# EAGLE design Schematic (EAGLE 9.4.2)
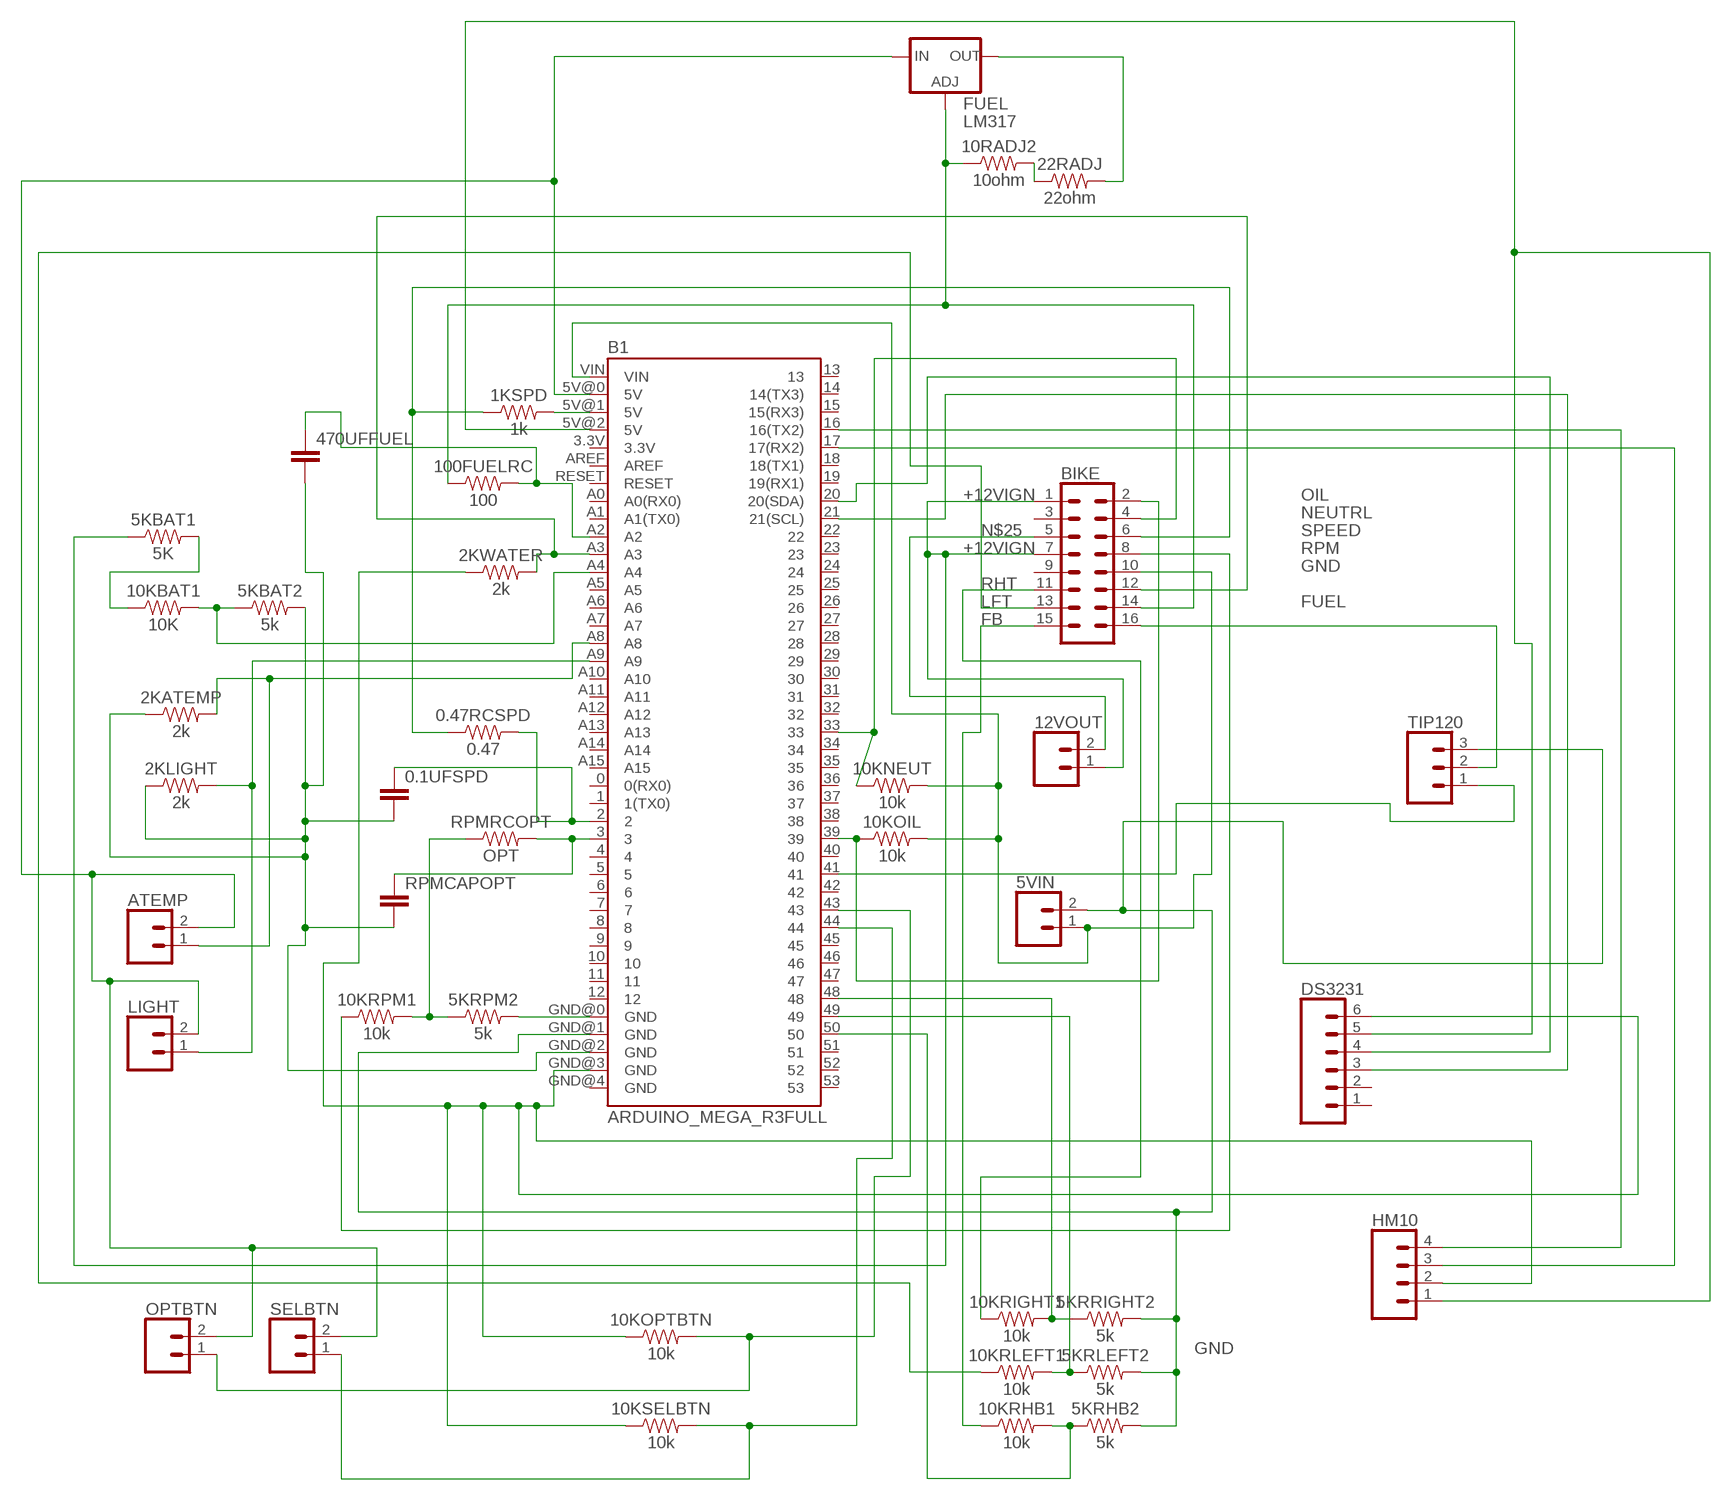
[diagram p0: schematic, sheet 1]

## Parts
0.1UFSPD  C2,5-3  [C2.5-3]
0.47RCSPD  0.47  1KOHM-HORIZ-1/4W-5%  [AXIAL-0.3]
1KSPD  1k  1KOHM-HORIZ-1/4W-5%  [AXIAL-0.3]
2KATEMP  2k  1KOHM-HORIZ-1/4W-5%  [AXIAL-0.3]
2KLIGHT  2k  1KOHM-HORIZ-1/4W-5%  [AXIAL-0.3]
2KWATER  2k  1KOHM-HORIZ-1/4W-5%  [AXIAL-0.3]
5KBAT1  5K  1KOHM-HORIZ-1/4W-5%  [AXIAL-0.3]
5KBAT2  5k  1KOHM-HORIZ-1/4W-5%  [AXIAL-0.3]
5KRHB2  5k  1KOHM-HORIZ-1/4W-5%  [AXIAL-0.3]
5KRLEFT2  5k  1KOHM-HORIZ-1/4W-5%  [AXIAL-0.3]
5KRPM2  5k  1KOHM-HORIZ-1/4W-5%  [AXIAL-0.3]
5KRRIGHT2  5k  1KOHM-HORIZ-1/4W-5%  [AXIAL-0.3]
5VIN  CONN_02PTH4  [1X02_XTRA_BIG]
10KBAT1  10K  1KOHM-HORIZ-1/4W-5%  [AXIAL-0.3]
10KNEUT  10k  1KOHM-HORIZ-1/4W-5%  [AXIAL-0.3]
10KOIL  10k  1KOHM-HORIZ-1/4W-5%  [AXIAL-0.3]
10KOPTBTN  10k  1KOHM-HORIZ-1/4W-5%  [AXIAL-0.3]
10KRHB1  10k  1KOHM-HORIZ-1/4W-5%  [AXIAL-0.3]
10KRIGHT1  10k  1KOHM-HORIZ-1/4W-5%  [AXIAL-0.3]
10KRLEFT1  10k  1KOHM-HORIZ-1/4W-5%  [AXIAL-0.3]
10KRPM1  10k  1KOHM-HORIZ-1/4W-5%  [AXIAL-0.3]
10KSELBTN  10k  1KOHM-HORIZ-1/4W-5%  [AXIAL-0.3]
10RADJ2  10ohm  1KOHM-HORIZ-1/4W-5%  [AXIAL-0.3]
12VOUT  CONN_02PTH4  [1X02_XTRA_BIG]
22RADJ  22ohm  1KOHM-HORIZ-1/4W-5%  [AXIAL-0.3]
100FUELRC  100  1KOHM-HORIZ-1/4W-5%  [AXIAL-0.3]
470UFFUEL  C2,5-3  [C2.5-3]
ATEMP  CONN_02  [1X02]
B1  ARDUINO_MEGA_R3FULL  [ARDUINO_MEGA]
BIKE  CONN_08X2  [2X8]
DS3231  CONN_06SILK_FEMALE_PTH  [1X06]
FUEL  LM317  V_REG_317SINK  [TO220-ADJ]
HM10  CONN_04  [1X04]
LIGHT  CONN_02  [1X02]
OPTBTN  CONN_02  [1X02]
RPMCAPOPT  C2,5-3  [C2.5-3]
RPMRCOPT  OPT  1KOHM-HORIZ-1/4W-5%  [AXIAL-0.3]
SELBTN  CONN_02  [1X02]
TIP120  CONN_03  [1X03]

## Nets
+12VIGN: 5KBAT1.P$1 12VOUT.1 BIKE.1 BIKE.7
FB: 10KRHB1.P$1 BIKE.15
FUEL: 10RADJ2.P$1 100FUELRC.P$1 BIKE.14 FUEL.ADJ
GND: 5KRHB2.P$2 5KRLEFT2.P$2 5KRRIGHT2.P$2 5VIN.2 B1.GND@1(GND) TIP120.3
LFT: 10KRLEFT1.P$1 BIKE.13
N$1: 2KWATER.P$2 B1.A3 BIKE.12
N$2: 1KSPD.P$2 B1.5V@1(5V)
N$3: 5KRPM2.P$2 B1.GND@0(GND)
N$4: 5KRPM2.P$1 10KRPM1.P$2 RPMRCOPT.P$1
N$5: 2KWATER.P$1 10KOPTBTN.P$1 10KSELBTN.P$1 B1.GND@3(GND) DS3231.6 HM10.2
N$6: 5KBAT1.P$2 10KBAT1.P$1
N$7: 22RADJ.P$2 FUEL.OUT
N$8: 0.1UFSPD.1 0.47RCSPD.P$2 B1.2
N$9: ATEMP.2 B1.5V@0(5V) FUEL.IN LIGHT.2 OPTBTN.2 SELBTN.2
N$10: B1.3 RPMCAPOPT.1 RPMRCOPT.P$2
N$11: 10RADJ2.P$2 22RADJ.P$1
N$12: 5VIN.1 10KNEUT.P$2 10KOIL.P$2 B1.VIN BIKE.10
N$13: B1.41 TIP120.1
N$14: BIKE.16 TIP120.2
N$15: 5KBAT2.P$1 10KBAT1.P$2 B1.A4
N$16: 0.1UFSPD.2 2KATEMP.P$1 2KLIGHT.P$1 5KBAT2.P$2 470UFFUEL.2 B1.GND@2(GND) RPMCAPOPT.2
N$17: 100FUELRC.P$2 470UFFUEL.1 B1.A2
N$18: 2KATEMP.P$2 ATEMP.1 B1.A8
N$19: 2KLIGHT.P$2 B1.A9 LIGHT.1
N$20: 10KOPTBTN.P$2 B1.43 OPTBTN.1
N$21: 10KSELBTN.P$2 B1.44 SELBTN.1
N$22: 5KRRIGHT2.P$1 10KRIGHT1.P$2 B1.48
N$23: 5KRLEFT2.P$1 10KRLEFT1.P$2 B1.49
N$24: 5KRHB2.P$1 10KRHB1.P$2 B1.50
N$25: 12VOUT.2 BIKE.5
N$26: B1.5V@2(5V) DS3231.5 HM10.1
N$27: B1.20(20(SDA)) DS3231.4
N$28: B1.21(21(SCL)) DS3231.3
N$29: B1.16(16(TX2)) HM10.4
N$30: B1.17(17(RX2)) HM10.3
NEUTRL: 10KNEUT.P$1 B1.33 BIKE.4
OIL: 10KOIL.P$1 B1.39 BIKE.2
RHT: 10KRIGHT1.P$1 BIKE.11
RPM: 10KRPM1.P$1 BIKE.8
SPEED: 0.47RCSPD.P$1 1KSPD.P$1 BIKE.6
Unconnected: B1.0(0(RX0)) B1.1(1(TX0)) B1.3.3V B1.4 B1.5 B1.6 B1.7 B1.8 B1.9 B1.10 B1.11 B1.12 B1.13 B1.14(14(TX3)) B1.15(15(RX3)) B1.18(18(TX1)) B1.19(19(RX1)) B1.22 B1.23 B1.24 B1.25 B1.26 B1.27 B1.28 B1.29 B1.30 B1.31 B1.32 B1.34 B1.35 B1.36 B1.37 B1.38 B1.40 B1.42 B1.45 B1.46 B1.47 B1.51 B1.52 B1.53 B1.A0(A0(RX0)) B1.A1(A1(TX0)) B1.A5 B1.A6 B1.A7 B1.A10 B1.A11 B1.A12 B1.A13 B1.A14 B1.A15 B1.AREF B1.GND@4(GND) B1.RESET BIKE.3 BIKE.9 DS3231.1 DS3231.2

## Library data of the parts
0.1UFSPD 470UFFUEL RPMCAPOPT = capacitor-wima:C: CAPACITOR naming: grid - package width
0.47RCSPD 2KATEMP 2KLIGHT 2KWATER 5KBAT1 5KBAT2 5KRHB2 5KRLEFT2 5KRPM2 5KRRIGHT2 10KBAT1 10KNEUT 10KOIL 10KOPTBTN 10KRHB1 10KRIGHT1 10KRLEFT1 10KRPM1 10KSELBTN 10RADJ2 22RADJ 100FUELRC RPMRCOPT = SparkFun-Resistors:1KOHM: 1kΩ resistor A resistor is a passive two-terminal electrical component that implements electrical resistance as a circuit element. Resistors act to reduce current flow, and, at the same time, act to lower voltage levels within circuits. - Wikipedia; PROD_ID: RES-08380; VALUE: 1k
1KSPD = SparkFun-Resistors:1KOHM: 1kΩ resistor A resistor is a passive two-terminal electrical component that implements electrical resistance as a circuit element. Resistors act to reduce current flow, and, at the same time, act to lower voltage levels within circuits. - Wikipedia; PROD_ID: RES-08380
5VIN 12VOUT ATEMP LIGHT OPTBTN SELBTN = SparkFun-Connectors:CONN_02: Multi connection point. Often used as Generic Header-pin footprint for 0.1 inch spaced/style header connections On any of the 0.1 inch spaced packages, you can populate with these: Break Away Headers - Straight <https://www.sparkfun.com/products/116> (PRT-00116) Break Away Male Headers - Right Angle <https://www.sparkfun.com/products/553> (PRT-00553) Female Headers <https://www.sparkfun.com/products/115> (PRT-00115) Break Away Headers - Machine Pin <https://www.sparkfun.com/products/117> (PRT-00117) Break Away Female Headers - Swiss Machine Pin <https://www.sparkfun.com/products/743> (PRT-00743) For SCREWTERMINALS and SPRING TERMINALS visit here: Screw Terimnals on SparkFun.com <https://www.sparkfun.com/search/results?term=Screw+Terminals> (5mm/3.5mm/2.54mm spacing) This device is also useful as a general connection point to wire up your design to another part of your project. Our various solder wires solder well into these plated through hole pads. Hook-Up Wire - Assortment (Stranded, 22 AWG) <https://www.sparkfun.com/products/11375> (PRT-11375) Hook-Up Wire - Assortment (Solid Core, 22 AWG) <https://www.sparkfun.com/products/11367> (PRT-11367) View the entire wire category on our website here <https://www.sparkfun.com/categories/141> Special notes: Molex polarized connector foot print use with: PRT-08233 with associated crimp pins and housings. 2.54_SCREWTERM for use with PRT-10571. 3.5mm Screw Terminal footprints for PRT-08084 5mm Screw Terminal footprints for use with PRT-08432
B1 = SparkFun-Boards:ARDUINO_MEGA_R3: Arduino Mega R3 ATmega2560 R3 compatible footprint. SparkFun Products: Arduino Mega 2560 R3 <https://www.sparkfun.com/products/11061>
BIKE = SparkFun-Connectors:CONN_08X2: Multi connection point. Often used as Generic Header-pin footprint for 0.1 inch spaced/style header connections You can populate with any combo of single row headers, but if you'd like an exact match, check this: Header - 2x8 (Male, 0.1") <https://www.sparkfun.com/products/13156> (PRT-13156) On any of the 0.1 inch spaced packages, you can populate with these: Break Away Headers - Straight <https://www.sparkfun.com/products/116> (PRT-00116) Break Away Male Headers - Right Angle <https://www.sparkfun.com/products/553> (PRT-00553) Female Headers <https://www.sparkfun.com/products/115> (PRT-00115) Break Away Headers - Machine Pin <https://www.sparkfun.com/products/117> (PRT-00117) Break Away Female Headers - Swiss Machine Pin <https://www.sparkfun.com/products/743> (PRT-00743)
DS3231 = SparkFun-Connectors:CONN_06: Multi connection point. Often used as Generic Header-pin footprint for 0.1 inch spaced/style header connections On any of the 0.1 inch spaced packages, you can populate with these: Break Away Headers - Straight <https://www.sparkfun.com/products/116> (PRT-00116) Break Away Male Headers - Right Angle <https://www.sparkfun.com/products/553> (PRT-00553) Female Headers <https://www.sparkfun.com/products/115> (PRT-00115) Break Away Headers - Machine Pin <https://www.sparkfun.com/products/117> (PRT-00117) Break Away Female Headers - Swiss Machine Pin <https://www.sparkfun.com/products/743> (PRT-00743) Arduino Stackable Header - 6 Pin <https://www.sparkfun.com/products/9280> (PRT-09280) For SCREWTERMINALS and SPRING TERMINALS visit here: Screw Terimnals on SparkFun.com <https://www.sparkfun.com/search/results?term=Screw+Terminals> (5mm/3.5mm/2.54mm spacing) This device is also useful as a general connection point to wire up your design to another part of your project. Our various solder wires solder well into these plated through hole pads. Hook-Up Wire - Assortment (Stranded, 22 AWG) <https://www.sparkfun.com/products/11375> (PRT-11375) Hook-Up Wire - Assortment (Solid Core, 22 AWG) <https://www.sparkfun.com/products/11367> (PRT-11367) View the entire wire category on our website here <https://www.sparkfun.com/categories/141>; PROD_ID: CONN-08437
FUEL = SparkFun-IC-Power:V_REG_317: Voltage Regulator Standard LM317 adjustable voltage regulator. AOI (Adjust Output Input). Google 'LM317 Calculator' for easy to use app to get the two resistor values needed. 240/720 for 5V output. 240/390 for 3.3V output. Spark Fun Electronics SKU : COM-00527
HM10 = SparkFun-Connectors:CONN_04: Multi connection point. Often used as Generic Header-pin footprint for 0.1 inch spaced/style header connections On any of the 0.1 inch spaced packages, you can populate with these: Break Away Headers - Straight <https://www.sparkfun.com/products/116> (PRT-00116) Break Away Male Headers - Right Angle <https://www.sparkfun.com/products/553> (PRT-00553) Female Headers <https://www.sparkfun.com/products/115> (PRT-00115) Break Away Headers - Machine Pin <https://www.sparkfun.com/products/117> (PRT-00117) Break Away Female Headers - Swiss Machine Pin <https://www.sparkfun.com/products/743> (PRT-00743) For SCREWTERMINALS and SPRING TERMINALS visit here: Screw Terimnals on SparkFun.com <https://www.sparkfun.com/search/results?term=Screw+Terminals> (5mm/3.5mm/2.54mm spacing) This device is also useful as a general connection point to wire up your design to another part of your project. Our various solder wires solder well into these plated through hole pads. Hook-Up Wire - Assortment (Stranded, 22 AWG) <https://www.sparkfun.com/products/11375> (PRT-11375) Hook-Up Wire - Assortment (Solid Core, 22 AWG) <https://www.sparkfun.com/products/11367> (PRT-11367) View the entire wire category on our website here <https://www.sparkfun.com/categories/141> Special notes: Molex polarized connector foot print use with SKU : PRT-08231 with associated crimp pins and housings. 1MM SMD Version SKU: PRT-10208; PROD_ID: CONN-09696
TIP120 = SparkFun-Connectors:CONN_03: Multi connection point. Often used as Generic Header-pin footprint for 0.1 inch spaced/style header connections On any of the 0.1 inch spaced packages, you can populate with these: Break Away Headers - Straight <https://www.sparkfun.com/products/116> (PRT-00116) Break Away Male Headers - Right Angle <https://www.sparkfun.com/products/553> (PRT-00553) Female Headers <https://www.sparkfun.com/products/115> (PRT-00115) Break Away Headers - Machine Pin <https://www.sparkfun.com/products/117> (PRT-00117) Break Away Female Headers - Swiss Machine Pin <https://www.sparkfun.com/products/743> (PRT-00743) Stackable Header - 3 Pin (Female, 0.1") <https://www.sparkfun.com/products/13875> (PRT-13875) For SCREWTERMINALS and SPRING TERMINALS visit here: Screw Terimnals on SparkFun.com <https://www.sparkfun.com/search/results?term=Screw+Terminals> (5mm/3.5mm/2.54mm spacing) This device is also useful as a general connection point to wire up your design to another part of your project. Our various solder wires solder well into these plated through hole pads. Hook-Up Wire - Assortment (Stranded, 22 AWG) <https://www.sparkfun.com/products/11375> (PRT-11375) Hook-Up Wire - Assortment (Solid Core, 22 AWG) <https://www.sparkfun.com/products/11367> (PRT-11367) View the entire wire category on our website here <https://www.sparkfun.com/categories/141> Special notes: Molex polarized connector foot print use with SKU : PRT-08232 with associated crimp pins and housings.

## Board
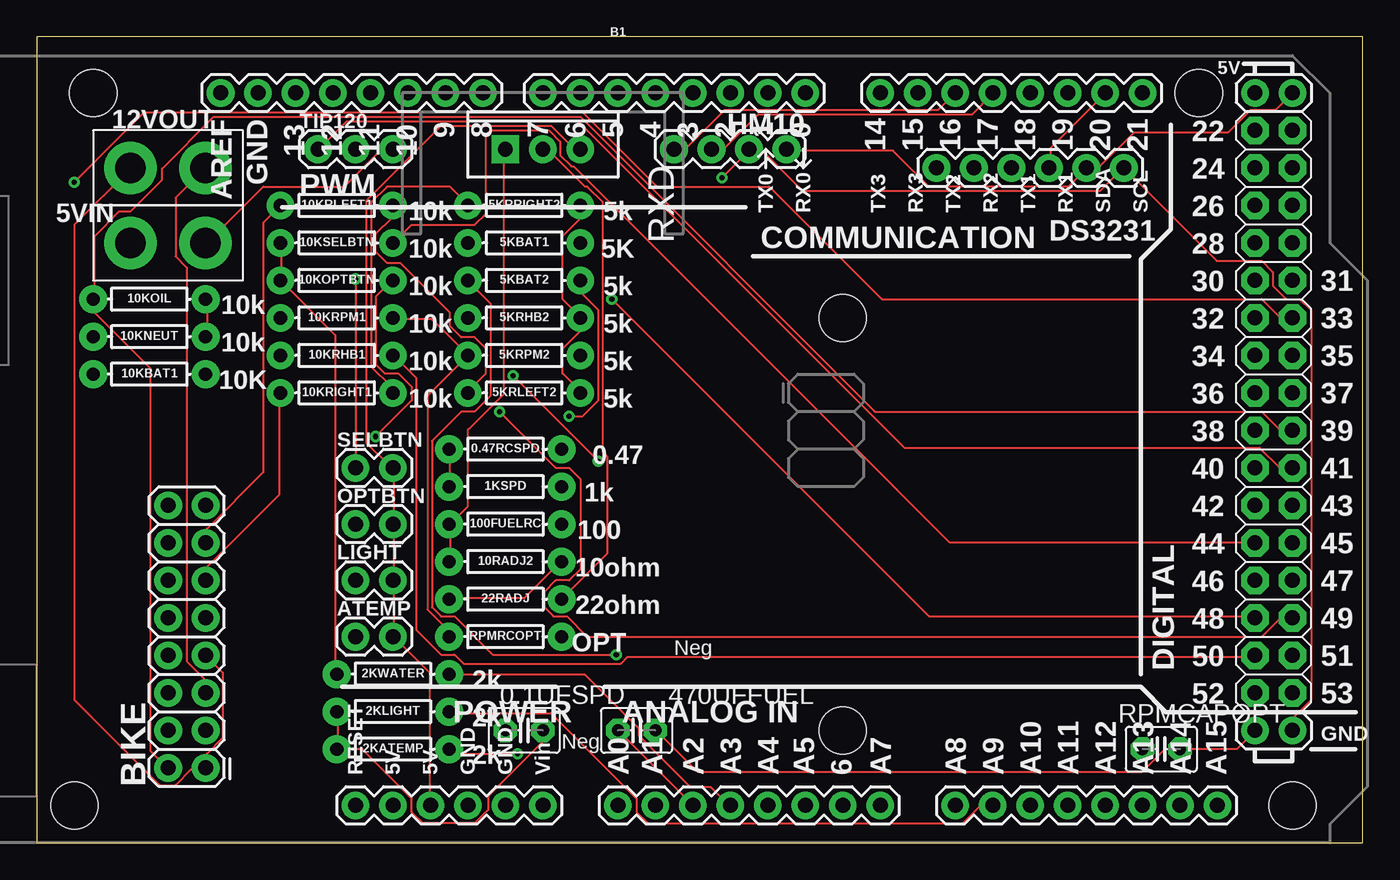
[diagram p1: board, top side]
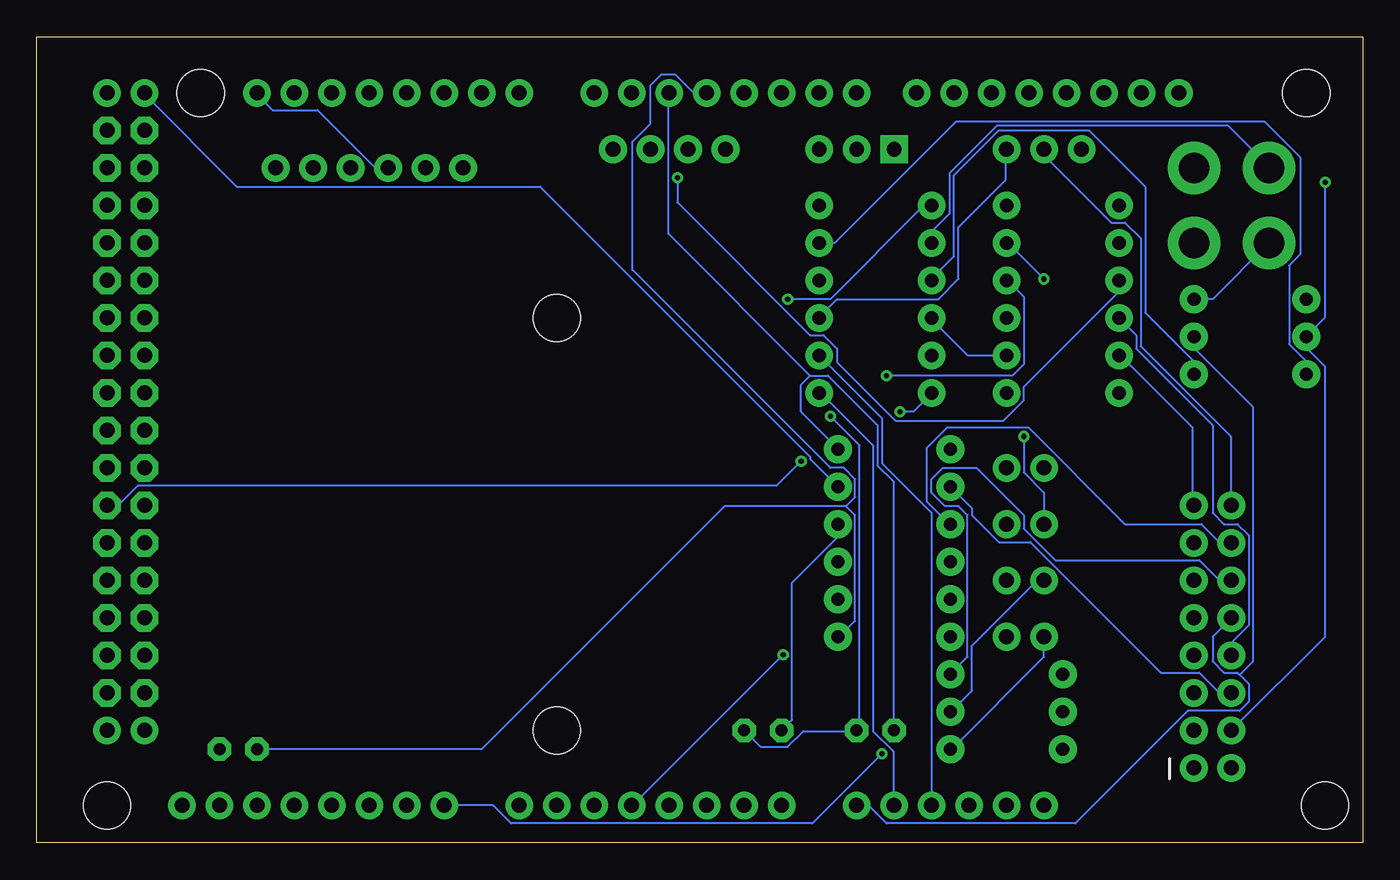
[diagram p2: board, bottom side, seen from below]

Size 89.84 x 54.6 mm. Coordinates in mm from the lower left corner, seen from the top.
Outline: 0,0 89.84,0 89.84,54.6 0,54.6 0,0
Copper layers (1*16): Top 0.035mm / dielectric 1.5mm / Bottom 0.035mm
Design rules "default": minimum track width 6mil, minimum drill 0.35mm, track to track 6mil, track to pad 6mil, pad to pad 6mil, via to via 6mil, smd to smd 6mil, copper to edge 40mil, drill to drill 6mil, minimum pad ring 10mil, minimum via ring 8mil, stop-mask expansion 4mil, vias tented up to drill 0mil, thermal gap 10mil

### Footprints (pad centres in the part's own frame; a part is rotated, then mirrored left to right if it is on the bottom)
C2.5-3 = drill 0.813 pad 1.6 octagon: 1 -1.27,0; 2 1.27,0
AXIAL-0.3 = drill 0.9 pad 1.88: P$1 -3.81,0; P$2 3.81,0
1X02_XTRA_BIG = drill 2.057 pad 3.556: 1 -2.54,0; 2 2.54,0
1X02 = drill 1.016 pad 1.88: 1 0,0; 2 2.54,0
ARDUINO_MEGA = drill 1.016 pad 1.88: 0 13.97,24.13; 1 11.43,24.13; 2 8.89,24.13; 3 6.35,24.13; 3.3V -13.97,-24.13; 4 3.81,24.13; 5 1.27,24.13; 5V@0 -11.43,-24.13; 5V@1 44.45,24.13; 5V@2 46.99,24.13; 6 -1.27,24.13; 7 -3.81,24.13; 8 -7.874,24.13; 9 -10.414,24.13; 10 -12.954,24.13; 11 -15.494,24.13; 12 -18.034,24.13; 13 -20.574,24.13; 14 19.05,24.13; 15 21.59,24.13; 16 24.13,24.13; 17 26.67,24.13; 18 29.21,24.13; 19 31.75,24.13; 20 34.29,24.13; 21 36.83,24.13; A0 1.27,-24.13; A1 3.81,-24.13; A2 6.35,-24.13; A3 8.89,-24.13; A4 11.43,-24.13; A5 13.97,-24.13; A6 16.51,-24.13; A7 19.05,-24.13; A8 24.13,-24.13; A9 26.67,-24.13; A10 29.21,-24.13; A11 31.75,-24.13; A12 34.29,-24.13; A13 36.83,-24.13; A14 39.37,-24.13; A15 41.91,-24.13; AREF -25.654,24.13; GND@0 -8.89,-24.13; GND@1 -6.35,-24.13; GND@2 44.45,-19.05; GND@3 46.99,-19.05; GND@4 -23.114,24.13; RESET -16.51,-24.13; VIN -3.81,-24.13 | drill 1.016 pad 1.88 octagon: 22 44.45,21.59; 23 46.99,21.59; 24 44.45,19.05; 25 46.99,19.05; 26 44.45,16.51; 27 46.99,16.51; 28 44.45,13.97; 29 46.99,13.97; 30 44.45,11.43; 31 46.99,11.43; 32 44.45,8.89; 33 46.99,8.89; 34 44.45,6.35; 35 46.99,6.35; 36 44.45,3.81; 37 46.99,3.81; 38 44.45,1.27; 39 46.99,1.27; 40 44.45,-1.27; 41 46.99,-1.27; 42 44.45,-3.81; 43 46.99,-3.81; 44 44.45,-6.35; 45 46.99,-6.35; 46 44.45,-8.89; 47 46.99,-8.89; 48 44.45,-11.43; 49 46.99,-11.43; 50 44.45,-13.97; 51 46.99,-13.97; 52 44.45,-16.51; 53 46.99,-16.51 | hole 3.2: -34.29,24.13; -35.56,-24.13; 16.51,8.89; 16.51,-19.05; 40.64,24.13; 46.99,-24.13
2X8 = drill 1.016 pad 1.88: 1 0,0; 2 0,2.54; 3 2.54,0; 4 2.54,2.54; 5 5.08,0; 6 5.08,2.54; 7 7.62,0; 8 7.62,2.54; 9 10.16,0; 10 10.16,2.54; 11 12.7,0; 12 12.7,2.54; 13 15.24,0; 14 15.24,2.54; 15 17.78,0; 16 17.78,2.54
1X06 = drill 1.016 pad 1.88: 1 0,0; 2 2.54,0; 3 5.08,0; 4 7.62,0; 5 10.16,0; 6 12.7,0
TO220-ADJ = drill 1 pad 1.88 square: ADJ -2.54,0 | drill 1 pad 1.88: IN 2.54,0; OUT 0,0
1X04 = drill 1.016 pad 1.88: 1 0,0; 2 2.54,0; 3 5.08,0; 4 7.62,0
1X03 = drill 1.016 pad 1.88: 1 0,0; 2 2.54,0; 3 5.08,0

### Placement (x,y rotation side)
0.1UFSPD  33.02,7.62 0 top
0.47RCSPD  31.75,26.67 0 top
1KSPD  31.75,24.13 0 top
2KATEMP  24.13,6.35 0 top
2KLIGHT  24.13,8.89 0 top
2KWATER  24.13,11.43 0 top
5KBAT1  33.02,40.64 0 top
5KBAT2  33.02,38.1 0 top
5KRHB2  33.02,35.56 0 top
5KRLEFT2  33.02,30.48 0 top
5KRPM2  33.02,33.02 0 top
5KRRIGHT2  33.02,43.18 0 top
5VIN  8.89,40.64 0 top
10KBAT1  7.62,31.75 0 top
10KNEUT  7.62,34.29 0 top
10KOIL  7.62,36.83 0 top
10KOPTBTN  20.32,38.1 0 top
10KRHB1  20.32,33.02 0 top
10KRIGHT1  20.32,30.48 0 top
10KRLEFT1  20.32,43.18 0 top
10KRPM1  20.32,35.56 0 top
10KSELBTN  20.32,40.64 0 top
10RADJ2  31.75,19.05 0 top
12VOUT  8.89,45.72 0 top
22RADJ  31.75,16.51 0 top
100FUELRC  31.75,21.59 0 top
470UFFUEL  40.64,7.62 0 top
ATEMP  21.59,13.97 0 top
B1  38.1,26.67 0 top
BIKE  11.43,5.08 90 top
DS3231  60.96,45.72 0 top
FUEL  34.29,46.99 0 top
HM10  50.8,46.99 180 top
LIGHT  21.59,17.78 0 top
OPTBTN  21.59,21.59 0 top
RPMCAPOPT  76.2,6.35 0 top
RPMRCOPT  31.75,13.97 0 top
SELBTN  21.59,25.4 0 top
TIP120  19.05,46.99 0 top

### Tracks (layer width: path | path; a pad name or v marks a point on that pad's centre or on a via)
+12VIGN
  Top 0.152: BIKE.7 12.6,11.53 12.6,7.11 11.53,6.04 11.53,5.13 BIKE.1 11.38,4.98 10.46,4.98 9.4,3.91 8.33,3.91 2.54,9.7 2.54,41.86 6.35,45.67 12VOUT.1
  Bottom 0.152: 5KBAT1.P$1 29.21,41.4 27.99,42.62 27.99,45.36 24.79,48.56 9.09,48.56 6.35,45.82 12VOUT.1
FB
  Bottom 0.152: BIKE.15 11.53,22.96 11.53,28.14 16.41,33.02 10KRHB1.P$1
FUEL
  Top 0.152: 27.99,21.59 27.99,19.15 10RADJ2.P$1 | 27.99,21.59 29.21,22.81 29.21,27.99 31.65,30.43 31.65,46.89 FUEL.ADJ | 27.99,21.59 100FUELRC.P$1
  Bottom 0.152: BIKE.14 8.94,20.37 9.7,20.37 10.92,21.59 16.1,21.59 22.66,28.14 28.14,28.14 29.52,26.77 29.52,23.11 27.99,21.59 100FUELRC.P$1
GND
  Top 0.152: TIP120.3 24.03,46.89 23.27,46.89 20.83,44.45 15.34,44.45 11.53,40.64 5VIN.2 | 5KRLEFT2.P$2 36.83,30.58 35.61,31.8 35.61,33.48 36.83,34.7 5KRHB2.P$2 36.83,35.61 35.61,36.83 35.61,41.1 36.83,42.32 5KRRIGHT2.P$2
  Bottom 0.152: B1.GND@1 31.8,2.54 31.8,6.2 33.17,7.57 33.17,26.92 36.83,30.58 5KRLEFT2.P$2 | TIP120.3 24.18,46.89 24.18,44.91 27.38,41.71 27.38,38.2 28.75,36.83 35.61,36.83 36.83,35.61 5KRHB2.P$2
LFT
  Top 0.152: 10KRLEFT1.P$1 15.34,42.01 15.34,25.09 11.53,21.29 11.53,20.37 BIKE.13
N$1
  Top 0.152: 2KWATER.P$2 27.99,11.38 37.13,11.38 40.79,7.72 40.79,7.26 44.3,3.76 45.67,3.76 46.89,2.54 B1.A3
  Bottom 0.152: BIKE.12 9.7,17.78 11.07,19.15 20.83,19.15 22.96,21.29 22.96,22.2 26.16,25.4 28.45,25.4 29.21,24.64 29.21,23.72 28.3,22.81 27.38,22.81 26.77,22.2 26.77,12.6 2KWATER.P$2
N$2
  Bottom 0.152: 1KSPD.P$2 37.44,26.01 37.44,26.16 55.73,44.45 76.3,44.45 82.55,50.7 B1.5V@1
N$3
  Bottom 0.152: B1.GND@0 29.21,22.35 32.56,25.71 32.56,28.75 5KRPM2.P$2
N$4
  Top 0.152: 10KRPM1.P$2 24.18,35.46 26.77,35.46 5KRPM2.P$1 26.47,30.28 26.47,15.8 27.84,14.43 27.84,13.97 RPMRCOPT.P$1
N$5  (via drill 0.35)
  Top 0.152: 10KSELBTN.P$1 16.56,40.64 16.56,38.2 10KOPTBTN.P$1 20.22,34.39 20.22,11.53 2KWATER.P$1 | B1.GND@3 85.14,7.72 85.14,8.48 86.36,9.7 86.36,36.07 85.6,36.83 84.68,36.83 83.77,37.74 83.77,38.66 83.01,39.42 79.96,39.42 DS3231.6 73.56,45.67 72.03,44.14 51.92,44.14 49.17,46.89 48.26,46.89 | 48.26,46.89 v46.43,45.06 | 48.26,46.89 HM10.2
  Bottom 0.152: v46.43,45.06 46.43,43.38 37.44,34.39 36.52,34.39 35.61,33.48 35.61,32.56 31.65,28.6 24.33,28.6 22.96,29.97 22.96,30.89 16.56,37.29 16.56,38.05 10KOPTBTN.P$1
N$6
  Bottom 0.152: 5KBAT1.P$2 35.76,40.64 27.53,48.87 6.65,48.87 4.22,46.43 4.22,39.88 4.98,39.12 4.98,33.78 3.91,32.71 3.91,31.8 10KBAT1.P$1
N$7
  Top 0.152: 22RADJ.P$2 38.66,19.61 38.66,26.16 38.35,26.47 38.35,43.38 37.29,44.45 37.13,44.45 34.7,46.89 34.39,46.89 FUEL.OUT
N$8
  Bottom 0.152: 37.44,31.65 36.22,31.65 32.87,28.3 32.87,25.55 31.8,24.49 31.8,7.72 0.1UFSPD.1 | 37.44,31.65 38.05,31.04 38.05,29.21 35.61,26.77 0.47RCSPD.P$2 | 37.44,31.65 47.04,41.25 47.04,50.7 B1.2
N$9
  Top 0.152: 24.18,17.78 24.18,13.97 | 24.18,13.97 26.62,11.53 26.62,2.54 B1.5V@0 | 24.18,13.97 ATEMP.2 | 24.18,21.59 24.18,25.4 SELBTN.2 24.03,25.4 22.35,27.08 22.35,43.54 27.38,48.56 34.85,48.56 36.37,47.04 36.83,47.04 FUEL.IN | 24.18,21.59 24.18,17.78 | 24.18,17.78 LIGHT.2 | 24.18,21.59 OPTBTN.2
N$10
  Bottom 0.152: RPMCAPOPT.1 59.69,6.35 43.23,22.81 35,22.81 | 35,22.81 34.39,22.2 34.39,15.04 35.46,13.97 RPMRCOPT.P$2 | 35,22.81 34.39,23.42 34.39,24.64 35.15,25.4 36.07,25.4 49.48,38.81 49.48,47.5 48.26,48.72 48.26,51.31 47.5,52.07 46.58,52.07 45.36,50.85 44.45,50.85 B1.3
N$11
  Top 0.152: 22RADJ.P$1 27.99,16.56 33.02,16.56 35.46,19 10RADJ2.P$2
N$12
  Top 0.152: 10KNEUT.P$2 11.53,34.39 11.53,36.83 10KOIL.P$2
  Bottom 0.152: 10KOIL.P$2 10.16,36.83 5VIN.1 | B1.VIN 33.48,2.54 32.26,1.32 19.46,1.32 11.84,8.94 8.33,8.94 7.72,9.55 7.72,10.77 8.33,11.38 | 8.33,11.38 8.48,11.53 9.4,11.53 10.16,12.29 10.16,13.97 BIKE.10 | 8.33,11.38 7.42,12.29 7.42,29.52 11.38,33.48 11.38,34.24 10KNEUT.P$2
N$13
  Top 0.152: B1.41 84.23,25.4 82.86,26.77 58.78,26.77 36.68,48.87 20.98,48.87 19.15,47.04 TIP120.1
N$14
  Bottom 0.152: TIP120.2 21.59,46.58 17.02,42.01 16.1,42.01 15.04,40.95 15.04,33.63 8.94,27.53 8.94,22.96 BIKE.16
N$15  (via drill 0.35)
  Top 0.152: v39.27,12.75 30.89,12.75 28.3,15.34 27.38,15.34 26.77,15.95 26.77,27.23 28.75,29.21 29.67,29.21 30.73,30.28 30.73,36.52 29.21,38.05 5KBAT2.P$1
  Bottom 0.152: 10KBAT1.P$2 11.53,31.8 11.53,32.71 14.73,35.92 14.73,44.45 18.54,48.26 24.64,48.26 27.69,45.21 27.69,39.73 29.21,38.2 5KBAT2.P$1 | v39.27,12.75 49.48,2.54 B1.A4
N$16  (via drill 0.35)
  Top 0.152: B1.GND@2 82.55,7.57 81.33,6.35 RPMCAPOPT.2 76.45,6.35 74.93,4.83 44.76,4.83 42.01,7.57 470UFFUEL.2 | 20.37,6.35 20.37,8.79 2KLIGHT.P$1 | 5KBAT2.P$2 36.83,37.29 38.05,36.07 38.05,29.97 36.98,28.91 v36.07,28.91 | 20.37,6.35 22.05,6.35 25.4,3 25.4,2.08 26.16,1.32 29.67,1.32 30.58,2.23 30.58,3.15 34.24,6.81 34.24,7.57 0.1UFSPD.2 | 20.37,6.35 2KATEMP.P$1
  Bottom 0.152: 470UFFUEL.2 40.79,6.5 38.96,6.5 37.9,7.57 34.39,7.57 0.1UFSPD.2 34.24,7.72 34.09,7.87 34.09,26.92 v36.07,28.91
N$17
  Top 0.152: B1.A2 470UFFUEL.1
  Bottom 0.152: 470UFFUEL.1 38.66,8.33 38.66,17.63 35.61,20.68 35.61,21.59 100FUELRC.P$2
N$18  (via drill 0.35)
  Top 0.152: v32.56,6.04 28.3,6.04 27.99,6.35 2KATEMP.P$2
  Bottom 0.152: ATEMP.1 21.59,12.6 27.84,6.35 2KATEMP.P$2 | B1.A8 58.93,2.54 57.71,1.32 37.29,1.32 v32.56,6.04
N$19
  Top 0.152: B1.A9 63.96,2.54 62.74,1.32 41.4,1.32 40.64,2.08 40.64,3 34.85,8.79 27.99,8.79 2KLIGHT.P$2
  Bottom 0.152: LIGHT.1 22.05,17.78 26.47,13.36 26.47,10.31 27.84,8.94 2KLIGHT.P$2
N$20  (via drill 0.35)
  Top 0.152: v22.96,27.53 25.4,29.97 25.4,30.89 24.49,31.8 23.57,31.8 22.96,32.41 22.96,36.98 24.03,38.05 10KOPTBTN.P$2 | v32.26,31.65 v38.05,25.86
  Bottom 0.152: OPTBTN.1 21.59,23.72 22.96,25.09 v22.96,27.53 | v38.05,25.86 39.73,24.18 83.01,24.18 84.23,22.96 84.99,22.96 B1.43 | v32.26,31.65 23.72,31.65 22.96,32.41 22.96,36.98 24.03,38.05 10KOPTBTN.P$2
N$21  (via drill 0.35)
  Top 0.152: v21.59,38.2 SELBTN.1 | B1.44 82.55,20.37 61.82,20.37 36.37,45.82 36.22,45.82 35.46,46.58 35.46,47.5 34.7,48.26 30.73,48.26 30.43,47.95 30.43,42.62 29.67,41.86 25.4,41.86 24.18,40.64 10KSELBTN.P$2
  Bottom 0.152: v21.59,38.2 24.03,40.64 10KSELBTN.P$2
N$22  (via drill 0.35)
  Top 0.152: 10KRIGHT1.P$2 24.03,30.58 24.03,30.89 22.66,32.26 22.66,43.38 23.72,44.45 27.99,44.45 29.21,43.23 5KRRIGHT2.P$1 | v38.96,36.83 60.45,15.34 82.55,15.34 B1.48
  Bottom 0.152: v38.96,36.83 36.07,36.83 29.82,43.08 29.21,43.08 5KRRIGHT2.P$1
N$23  (via drill 0.35)
  Top 0.152: 10KRLEFT1.P$2 24.03,43.08 24.03,42.32 22.96,41.25 22.96,40.03 23.72,39.27 24.64,39.27 27.99,35.92 27.99,35 28.75,34.24 29.67,34.24 30.43,33.48 30.43,31.8 29.21,30.58 5KRLEFT2.P$1 | v31.34,29.21 35.15,25.4 36.07,25.4 36.83,24.64 36.83,18.54 36.07,17.78 35.15,17.78 34.39,17.02 34.39,15.95 35,15.34 35.92,15.34 37.29,13.97 83.01,13.97 84.23,15.19 84.99,15.19 B1.49
  Bottom 0.152: v31.34,29.21 30.43,29.21 29.21,30.43 5KRLEFT2.P$1
N$24
  Top 0.152: B1.50 82.55,12.6 40.03,12.6 39.57,12.14 28.91,12.14 28.3,12.75 27.38,12.75 25.7,14.43 25.7,31.5 24.18,33.02 10KRHB1.P$2
  Bottom 0.152: 10KRHB1.P$2 26.77,33.02 29.21,35.46 5KRHB2.P$1
N$25
  Top 0.152: 12VOUT.2 9.4,43.69 9.4,39.73 10.16,38.96 10.16,12.29 11.38,11.07 11.38,10.16 BIKE.5
N$26
  Top 0.152: B1.5V@2 83.92,49.63 82.25,49.63 80.72,48.11 74.32,48.11 72.03,45.82 71.12,45.82 DS3231.5 71.12,45.67 69.9,44.45 60.45,44.45 58.01,46.89 50.85,46.89 HM10.1
N$27
  Top 0.152: DS3231.4 68.68,45.82 68.68,47.04 72.34,50.7 B1.20
N$28
  Bottom 0.152: DS3231.3 66.09,45.82 67,45.82 70.81,49.63 73.86,49.63 74.93,50.7 B1.21
N$29
  Top 0.152: B1.16 61.06,49.63 46.58,49.63 43.99,47.04 43.23,47.04 HM10.4
N$30
  Top 0.152: HM10.3 45.82,47.04 46.58,47.04 48.87,49.33 63.35,49.33 64.72,50.7 B1.17
NEUTRL  (via drill 0.35)
  Top 0.152: v2.54,44.75 7.26,49.48 36.98,49.48 42.01,44.45 49.63,44.45 57.25,36.83 83.01,36.83 84.23,35.61 84.99,35.61 B1.33
  Bottom 0.152: BIKE.4 2.54,13.97 2.54,32.26 3.76,33.48 3.76,34.24 10KNEUT.P$1 3.76,34.39 2.54,35.61 v2.54,44.75
OIL
  Top 0.152: 3.91,36.83 3.91,35.92 7.72,32.11 7.72,6.2 8.79,5.13 BIKE.2 | 3.91,36.83 3.91,41.1 5.59,42.77 6.35,42.77 8.48,44.91 8.48,45.67 11.99,49.17 36.83,49.17 56.79,29.21 83.01,29.21 84.23,27.99 84.99,27.99 B1.39 | 3.91,36.83 10KOIL.P$1
RHT
  Top 0.152: BIKE.11 11.53,17.78 11.53,18.69 16.41,23.57 16.41,30.43 10KRIGHT1.P$1
RPM
  Bottom 0.152: 10KRPM1.P$1 15.34,34.39 15.34,33.48 10.16,28.3 10.16,22.35 9.4,21.59 8.48,21.59 7.72,20.83 7.72,14.73 8.79,13.67 8.79,12.75 BIKE.8
SPEED
  Top 0.152: 0.47RCSPD.P$1 27.99,26.62 27.99,24.18 1KSPD.P$1
  Bottom 0.152: BIKE.6 9.7,10.16 11.07,11.53 13.66,11.53 22.5,20.37 24.64,20.37 26.47,22.2 26.47,22.66 1KSPD.P$1

### Text on the board
tNames: RXD | Neg | Neg